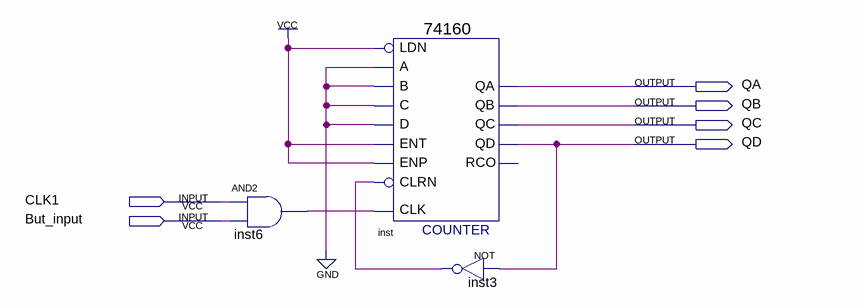
[diagram p0: schematic sheet]
// Quartus schematic distinctHZ.bdf as structural Verilog: 3 symbols, 6 pins
module distinctHZ (
  input  CLK1,
  input  But_input,
  output QA,
  output QB,
  output QC,
  output QD
);

  wire inst3_out, inst6_out;

  and inst6 (inst6_out, CLK1, But_input);
  \74160  inst (
    .CLK(inst6_out), .ENT(1'b1), .A(1'b0), .B(1'b0), .C(1'b0), .D(1'b0), .LDN(1'b1), .ENP(1'b1),
    .CLRN(inst3_out), .QD(QD), .QA(QA), .QB(QB), .QC(QC));  // open: RCO
  not inst3 (inst3_out, QD);
endmodule
